# Altium schematic sheet HiloV2.SchDoc
size A4
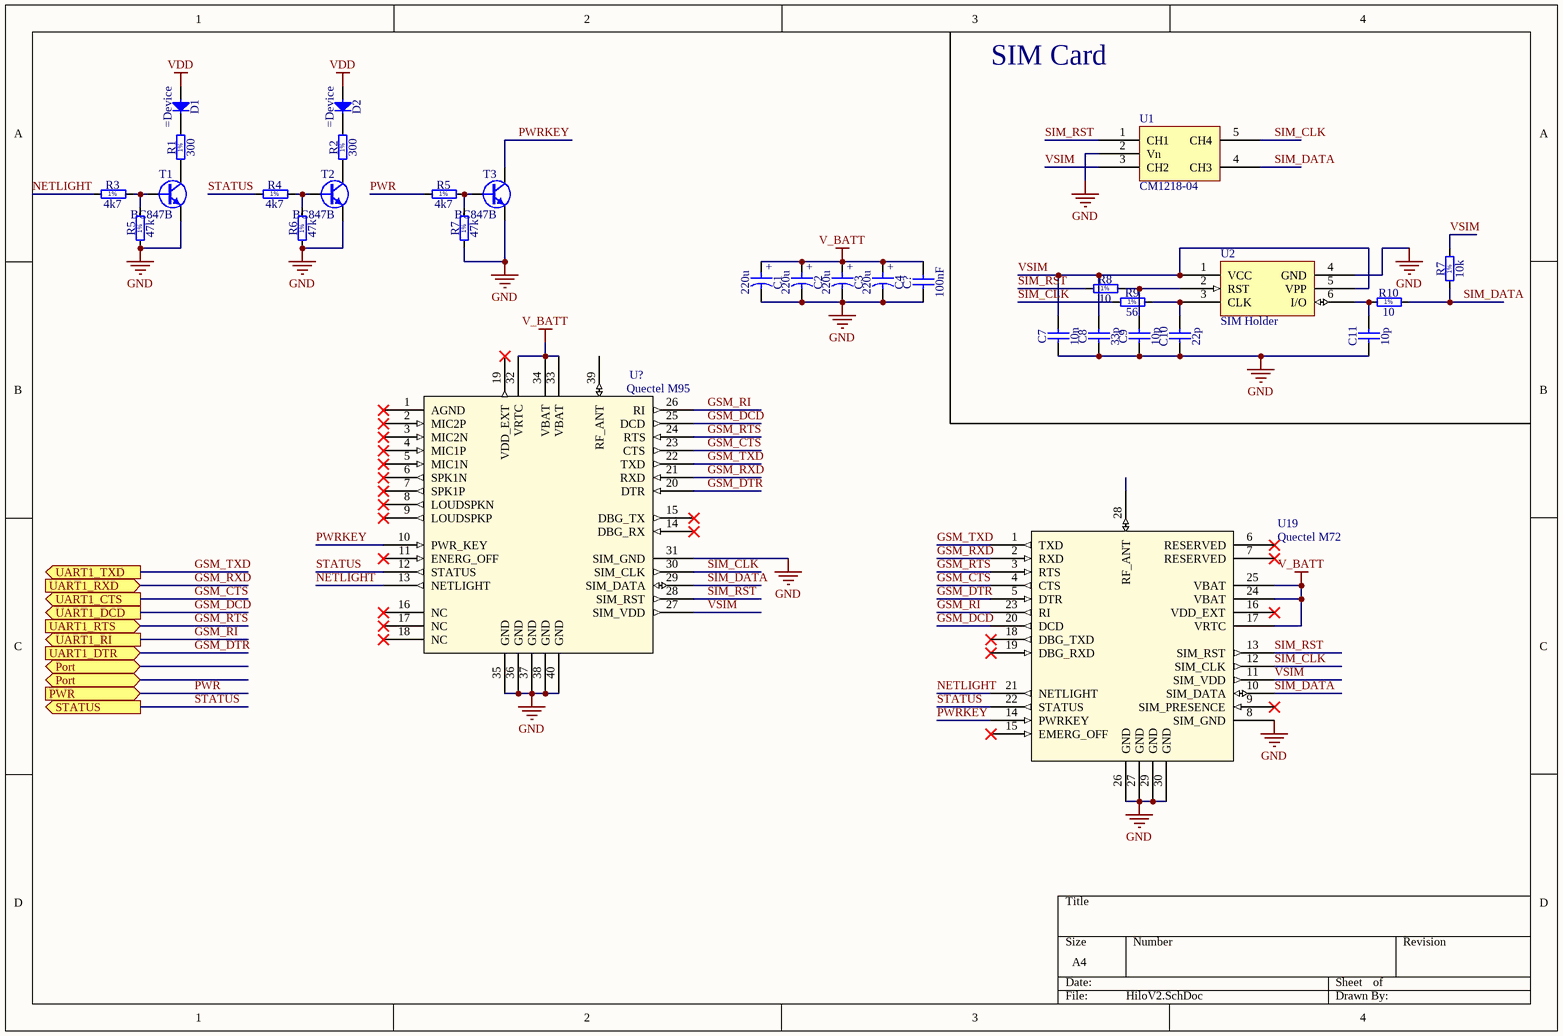
[diagram p0: HiloV2.SchDoc]

## Parts
(Parts that share a designator on the sheet are numbered #1, #2 ... from top to bottom, then left to right.)
C1  220u  [CAPMP7343X310N]
C2  220u  [CAPMP7343X310N]
C3  220u  [CAPMP7343X310N]
C4  220u  [CAPMP7343X310N]
C7  10n  [CAPC1608X90N]
C8  33p  [CAPC1608X90N]
C9  10p  [CAPC1608X90N]
C10  22p  [CAPC1608X90N]
C11  10p  [CAPC1608X90N]
C?  100nF  [CAPC1608X87N]
D1  (no value)  [LED_DIODE_0603]
D2  (no value)  [LED_DIODE_0603]
R1  300  [RESC1608X55N]
R2  300  [RESC1608X55N]
R3  4k7  [RESC1608X55N]
R4  4k7  [RESC1608X55N]
R5#1  4k7  [RESC1608X55N]
R5#2  47k  [RESC1608X55N]
R6  47k  [RESC1608X55N]
R7#1  47k  [RESC1608X55N]
R7#2  10k  [RESC1608X50N]
R8  10  [RESC1608X50N]
R9  56  [RESC1608X50N]
R10  10  [RESC1608X50N]
T1  BC847B  [SOT95P230X110-3N]
T2  BC847B  [SOT95P230X110-3N]
T3  BC847B  [SOT95P230X110-3N]
U1  CM1218-04  [ESD PROTECTOR]
U2  SIM Holder  [MOLEX - 0473882001]
U19  Quectel M72  [Quectel M72 GSM Module]
U?  Quectel M95  [QUECTEL M95]

## Ports
Port, PWR (in), STATUS (out), UART1_CTS (out), UART1_DCD (out), UART1_DTR (in), UART1_RI (out), UART1_RTS (in), UART1_RXD (in), UART1_TXD (out)

## Nets
GND: C1.2 C2.2 C3.2 C4.2 C7.1 C8.1 C9.1 C10.1 C11.1 C?.1 R5#2.1 R6.1 R7#1.1 T1.2(E) T2.2(E) T3.2(E) U1.2(Vn) U2.4(GND) U19.8(SIM_GND) U19.26(GND) U19.27(GND) U19.29(GND) U19.30(GND) U?.31(SIM_GND) U?.35(GND) U?.36(GND) U?.37(GND) U?.38(GND) U?.40(GND)
V_BATT: C1.1 C2.1 C3.1 C4.1 C?.2 U19.17(VRTC) U19.24(VBAT) U19.25(VBAT) U?.32(VRTC) U?.33(VBAT) U?.34(VBAT)
VDD: D1.2(A) D2.2(A)
GSM_CTS: U19.4(CTS) U?.23(CTS) ; port UART1_CTS
GSM_DCD: U19.20(DCD) U?.25(DCD) ; port UART1_DCD
GSM_DTR: U19.5(DTR) U?.20(DTR) ; port UART1_DTR
GSM_RI: U19.23(RI) U?.26(RI) ; port UART1_RI
GSM_RTS: U19.3(RTS) U?.24(RTS) ; port UART1_RTS
GSM_RXD: U19.2(RXD) U?.21(RXD) ; port UART1_RXD
GSM_TXD: U19.1(TXD) U?.22(TXD) ; port UART1_TXD
NETLIGHT: R3.1 U19.21(NETLIGHT) U?.13(NETLIGHT)
PWR: R5#1.1 ; port PWR
PWRKEY: T3.3(C) U19.14(PWRKEY) U?.10(PWR_KEY)
SIM_CLK: R9.1 U1.5(CH4) U19.12(SIM_CLK) U?.30(SIM_CLK)
SIM_DATA: R7#2.1 R10.2 U1.4(CH3) U19.10(SIM_DATA) U?.29(SIM_DATA)
SIM_RST: R8.1 U1.1(CH1) U19.13(SIM_RST) U?.28(SIM_RST)
STATUS: R4.1 U19.22(STATUS) U?.12(STATUS) ; port STATUS
VSIM: C7.2 C8.2 R7#2.2 U1.3(CH2) U2.1(VCC) U2.5(VPP) U19.11(SIM_VDD) U?.27(SIM_VDD)
NetC9_2: C9.2 R8.2 U2.2(RST)
NetC10_2: C10.2 R9.2 U2.3(CLK)
NetC11_2: C11.2 R10.1 U2.6(I/O)
NetD1_1: D1.1(C) R1.2
NetD2_1: D2.1(C) R2.2
NetR1_1: R1.1 T1.3(C)
NetR2_1: R2.1 T2.3(C)
NetR3_2: R3.2 R5#2.2 T1.1(B)
NetR4_2: R4.2 R6.2 T2.1(B)
NetR5#1_2: R5#1.2 R7#1.2 T3.1(B)

Not connected (* = marked no-connect by the designer): U19 6(RESERVED)* 7(RESERVED)* 9(SIM_PRESENCE)* 15(EMERG_OFF)* 16(VDD_EXT)* 18(DBG_TXD)* 19(DBG_RXD)* 28(RF_ANT); U? 1(AGND)* 2(MIC2P)* 3(MIC2N)* 4(MIC1P)* 5(MIC1N)* 6(SPK1N)* 7(SPK1P)* 8(LOUDSPKN)* 9(LOUDSPKP)* 11(ENERG_OFF)* 14(DBG_RX)* 15(DBG_TX)* 16(NC)* 17(NC)* 18(NC)* 19(VDD_EXT)* 39(RF_ANT)

## Notes on the sheet
- SIM Card
- (in symbol Capacitor - polarized) +
- (in symbol R0402_10K_1%_0.0625W_100PPM) 1%
- (in symbol R0603_4K7_1%_0.1W_100PPM) 1%
- (in symbol R0603_47K_1%_0.1W_100PPM) 1%
- (in symbol R0603_300R_1%_0.1W_100PPM) 1%
- (in symbol Resistor - 1%) 1%

## Library data of the parts
C1-C4 = Capacitor - polarized: KEMET T530D
C7-C11 = Capacitor - non polarized: Non-polarised capacitor
C? = CC0603_100NF_50V_10%_X7R: Non-polarised capacitor; Part Description: SMD Multilayer Chip Ceramic Capacitor; Manufacturer: GENERIC; Manufacturer1 Part Number: 223858615649; Voltage: 50V; TC: X7R; Tolerance: ±10%; Table: Capacitors SMD; Part Number: CC0603_100NF_50V_10%_X7R; Component Kind: Standard; Component Type: Standard; Pin Count: 2; Value: 100nF; Status: Preferred; Manufacturer Part Number: CC0603_100NF_50V_10%_X7R; Case: 0603; Mounted: Yes; Socket: No; SMD: Yes; Manufacturer1 Example: PHYCOMP; Manufacturer1 ComponentHeight: 0.87mm; HelpURL: \\cern.ch\dfs\Applications\Altium\Datasheets\CC0603_X7R_PHYCOMP.pdf; Author: CERN DEM JLC; CreateDate: 2007-12-03; LatestRevisionDate: 2007-12-03
D1 D2 = Diode
R1 R2 = R0603_300R_1%_0.1W_100PPM: Resistor - 1%; Part Description: General Purpose Thick Film Chip Resistor; Manufacturer: GENERIC; Manufacturer1 Part Number: NRC06F3000TRF; Power: 0.1W; TC: ±100ppm/°C; Table: Resistors SMD; Part Number: R0603_300R_1%_0.1W_100PPM; Component Kind: Standard; Component Type: Standard; Pin Count: 2; Value: 300; Status: Preferred; Tolerance: ±1%; Manufacturer Part Number: R0603_300R_1%_0.1W_100PPM; Case: 0603; Mounted: Yes; Socket: No; SMD: Yes; Manufacturer1 Example: NIC COMPONENT; Manufacturer1 ComponentHeight: 0.55mm; HelpURL: \\cern.ch\dfs\Applications\Altium\Datasheets\R0603_NIC_NRC.pdf; Author: CERN DEM JLC; CreateDate: 2007-12-03; LatestRevisionDate: 2008-03-13
R3 R4 R5#1 = R0603_4K7_1%_0.1W_100PPM: Resistor - 1%; Part Description: General Purpose Thick Film Chip Resistor; Manufacturer: GENERIC; Manufacturer1 Part Number: NRC06F4701TRF; Power: 0.1W; TC: ±100ppm/°C; Table: Resistors SMD; Part Number: R0603_4K7_1%_0.1W_100PPM; Component Kind: Standard; Component Type: Standard; Pin Count: 2; Value: 4k7; Status: Preferred; Tolerance: ±1%; Manufacturer Part Number: R0603_4K7_1%_0.1W_100PPM; Case: 0603; Mounted: Yes; Socket: No; SMD: Yes; Manufacturer1 Example: NIC COMPONENT; Manufacturer1 ComponentHeight: 0.55mm; HelpURL: \\cern.ch\dfs\Applications\Altium\Datasheets\R0603_NIC_NRC.pdf; Author: CERN DEM JLC; CreateDate: 2007-12-03; LatestRevisionDate: 2008-03-13
R5#2 R6 R7#1 = R0603_47K_1%_0.1W_100PPM: Resistor - 1%; Part Description: General Purpose Thick Film Chip Resistor; Manufacturer: GENERIC; Manufacturer1 Part Number: NRC06F4702TRF; Power: 0.1W; TC: ±100ppm/°C; Table: Resistors SMD; Part Number: R0603_47K_1%_0.1W_100PPM; Component Kind: Standard; Component Type: Standard; Pin Count: 2; Value: 47k; Status: Preferred; Tolerance: ±1%; Manufacturer Part Number: R0603_47K_1%_0.1W_100PPM; Case: 0603; Mounted: Yes; Socket: No; SMD: Yes; Manufacturer1 Example: NIC COMPONENT; Manufacturer1 ComponentHeight: 0.55mm; HelpURL: \\cern.ch\dfs\Applications\Altium\Datasheets\R0603_NIC_NRC.pdf; Author: CERN DEM JLC; CreateDate: 2007-12-03; LatestRevisionDate: 2008-03-13
R7#2 = R0402_10K_1%_0.0625W_100PPM: Resistor - 1%; Part Description: General Purpose Thick Film Chip Resistor; Manufacturer: GENERIC; Manufacturer1 Part Number: 232270671003; TC: ±100ppm/°C; Table: Resistors SMD; Part Number: R0402_10K_1%_0.0625W_100PPM; Component Kind: Standard; Component Type: Standard; Footprint: RESC1005X40N; Pin Count: 2; Value: 10k; Status: Not recommended; Power: 0.0625W; Tolerance: ±1%; Manufacturer Part Number: R0402_10K_1%_0.0625W_100PPM; Case: 0402; Mounted: Yes; Socket: No; SMD: Yes; Manufacturer1 Example: PHYCOMP; Manufacturer1 ComponentHeight: 0.4mm; HelpURL: \\cern.ch\dfs\Applications\Altium\Datasheets\R0402_Phycomp_RC0402.pdf; Author: CERN DEM JLC; CreateDate: 2007-12-03; LatestRevisionDate: 2008-03-13
R8-R10 = Resistor - 1%
T1-T3 = BC847B: NPN Transistor; Part Description: 45V, 100mA NPN general-purpose transistors; Manufacturer: NXP SEMICONDUCTORS; Table: Transistors; Part Number: BC847B; Component Kind: Standard; Component Type: Standard; Device: BC847B; PackageDescription: SOT23, 3 pin, Pitch 0.95mm - 1.3mm W X 2.9mm L X 1.1mm H, IPC Medium Density; Manufacturer Part Number: BC847B; Pin Count: 3; Case: SOT23-3; Mounted: Yes; Socket: No; SMD: Yes; ComponentHeight: 1.1mm; HelpURL: \\cern.ch\dfs\Applications\Altium\Datasheets\BC847B.pdf; Author: CERN DEM JLC; CreateDate: 2011-06-14; LatestRevisionDate: 2011-06-14
U1 = CM1218-04 ESD_Protector SOT23-5 Package: ESD_Protector SOT23-5 Package
U2 = SIM Holder: 6-pin SIM Holder
U19 = Quectel M72: GSM Module
U? = Quectel M95: GSM Module